# EAGLE schematic RF08b (EAGLE 6.6.0)

## Sheet 1 of 3
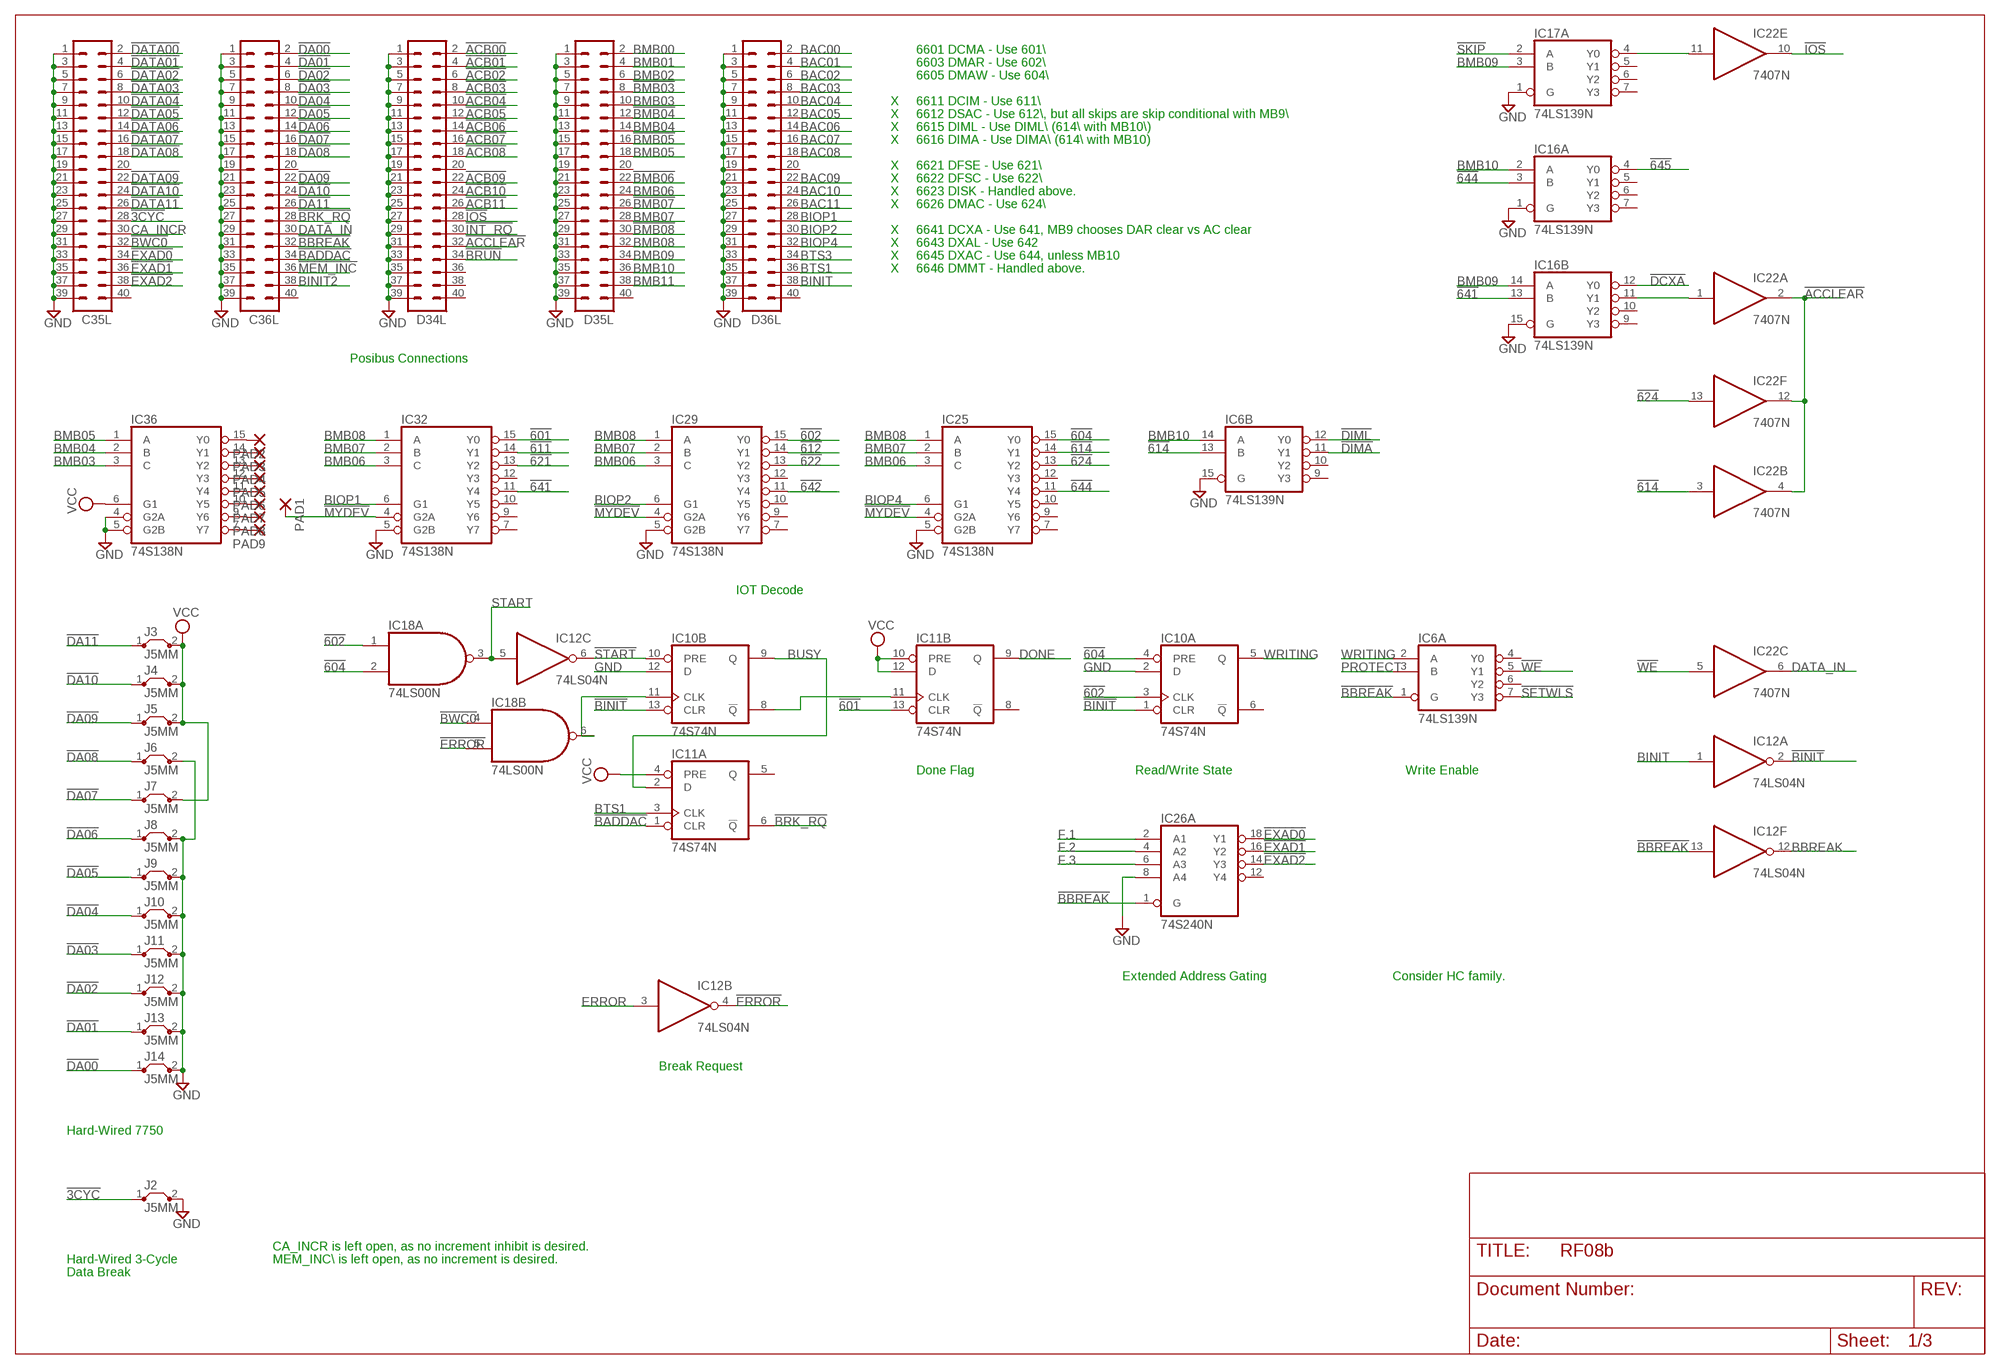
[diagram p0: schematic, sheet 1]

### Parts
C35L  MA20-2  [MA20-2]
C36L  MA20-2  [MA20-2]
D34L  MA20-2  [MA20-2]
D35L  MA20-2  [MA20-2]
D36L  MA20-2  [MA20-2]
IC6  74LS139N  74S139N  [DIL16]
IC10  74S74N  [DIL14]
IC11  74S74N  [DIL14]
IC12  74LS04N  [DIL14]
IC16  74LS139N  74S139N  [DIL16]
IC17  74LS139N  74S139N  [DIL16]
IC18  74LS00N  [DIL14]
IC22  7407N  [DIL14]
IC25  74S138N  [DIL16]
IC26  74S240N  [DIL20]
IC29  74S138N  [DIL16]
IC32  74S138N  [DIL16]
IC36  74S138N  [DIL16]
J2  J5MM  [05]
J3  J5MM  [05]
J4  J5MM  [05]
J5  J5MM  [05]
J6  J5MM  [05]
J7  J5MM  [05]
J8  J5MM  [05]
J9  J5MM  [05]
J10  J5MM  [05]
J11  J5MM  [05]
J12  J5MM  [05]
J13  J5MM  [05]
J14  J5MM  [05]
PAD1  1,6/0,8  [1,6/0,8]
PAD2  1,6/0,8  [1,6/0,8]
PAD3  1,6/0,8  [1,6/0,8]
PAD4  1,6/0,8  [1,6/0,8]
PAD5  1,6/0,8  [1,6/0,8]
PAD6  1,6/0,8  [1,6/0,8]
PAD7  1,6/0,8  [1,6/0,8]
PAD8  1,6/0,8  [1,6/0,8]
PAD9  1,6/0,8  [1,6/0,8]

### Nets
!3CYC: C35L.28 J2.1
!601: IC11.13(B:CLR) IC32.15(Y0) ; also sheet 2
!602: IC10.3(A:CLK) IC18.1(A:I0) IC29.15(Y0)
!604: IC10.4(A:PRE) IC18.2(A:I1) IC25.15(Y0)
!611: IC32.14(Y1) ; also sheet 2
!612: IC29.14(Y1) ; also sheet 2
!614: IC6.13(B:B) IC22.3(B:I) IC25.14(Y1)
!621: IC32.13(Y2) ; also sheet 2
!622: IC29.13(Y2) ; also sheet 2
!624: IC22.13(F:I) IC25.13(Y2) ; also sheet 2
!641: IC16.13(B:B) IC32.11(Y4)
!642: IC29.11(Y4) ; also sheet 2
!644: IC16.3(A:B) IC25.11(Y4)
!645: IC16.4(A:Y0) ; also sheet 2
!ACB00: D34L.2 ; also sheet 2
!ACB01: D34L.4 ; also sheet 2
!ACB02: D34L.6 ; also sheet 2
!ACB03: D34L.8 ; also sheet 2
!ACB04: D34L.10 ; also sheet 2
!ACB05: D34L.12 ; also sheet 2
!ACB06: D34L.14 ; also sheet 2
!ACB07: D34L.16 ; also sheet 2
!ACB08: D34L.18 ; also sheet 2
!ACB09: D34L.22 ; also sheet 2
!ACB10: D34L.24 ; also sheet 2
!ACB11: D34L.26 ; also sheet 2
!ACCLEAR: D34L.32 IC22.2(A:O) IC22.4(B:O) IC22.12(F:O)
!BADDAC: C36L.34 IC11.1(A:CLR)
!BBREAK: C36L.32 IC6.1(A:G) IC12.13(F:I) IC26.1(A:G) ; also sheet 3
!BINIT: IC10.1(A:CLR) IC10.13(B:CLR) IC12.2(A:O) ; also sheet 2
!BMB03: D35L.8
!BMB04: D35L.12
!BMB05: D35L.16
!BMB06: D35L.22
!BMB07: D35L.26
!BMB08: D35L.30
!BRK_RQ: C36L.28 IC11.6(A:!Q) ; also sheet 3
!BRUN: D34L.34
!BWC0: C35L.32 IC18.4(B:I0) ; also sheet 3
!DA00: C36L.2 J14.1
!DA01: C36L.4 J13.1
!DA02: C36L.6 J12.1
!DA03: C36L.8 J11.1
!DA04: C36L.10 J10.1
!DA05: C36L.12 J9.1
!DA06: C36L.14 J8.1
!DA07: C36L.16 J7.1
!DA08: C36L.18 J6.1
!DA09: C36L.22 J5.1
!DA10: C36L.24 J4.1
!DA11: C36L.26 J3.1
!DATA00: C35L.2 ; also sheet 3
!DATA01: C35L.4 ; also sheet 3
!DATA02: C35L.6 ; also sheet 3
!DATA03: C35L.8 ; also sheet 3
!DATA04: C35L.10 ; also sheet 3
!DATA05: C35L.12 ; also sheet 3
!DATA06: C35L.14 ; also sheet 3
!DATA07: C35L.16 ; also sheet 3
!DATA08: C35L.18 ; also sheet 3
!DATA09: C35L.22 ; also sheet 3
!DATA10: C35L.24 ; also sheet 3
!DATA11: C35L.26 ; also sheet 3
!DCXA: IC16.12(B:Y0) ; also sheet 2
!DIMA: IC6.11(B:Y1) ; also sheet 2
!DIML: IC6.12(B:Y0) ; also sheet 2
!ERROR: IC12.4(B:O) IC18.5(B:I1)
!EXAD0: C35L.34 IC26.18(A:Y1)
!EXAD1: C35L.36 IC26.16(A:Y2)
!EXAD2: C35L.38 IC26.14(A:Y3)
!INT_RQ: D34L.30 ; also sheet 2
!IOS: D34L.28 IC22.10(E:O)
!MEM_INC: C36L.36
!MYDEV: IC25.4(G2A) IC29.4(G2A) IC32.4(G2A) PAD1.1(P)
!SETWLS: IC6.7(A:Y3) ; also sheet 2
!SKIP: IC17.2(A:A) ; also sheet 2
!START: IC10.10(B:PRE) IC12.6(C:O) ; also sheet 2
!WE: IC6.5(A:Y1) IC22.5(C:I) ; also sheet 3
BAC00: D36L.2 ; also sheet 2
BAC01: D36L.4 ; also sheet 2
BAC02: D36L.6 ; also sheet 2
BAC03: D36L.8 ; also sheet 2
BAC04: D36L.10 ; also sheet 2
BAC05: D36L.12 ; also sheet 2
BAC06: D36L.14 ; also sheet 2
BAC07: D36L.16 ; also sheet 2
BAC08: D36L.18 ; also sheet 2
BAC09: D36L.22 ; also sheet 2
BAC10: D36L.24 ; also sheet 2
BAC11: D36L.26 ; also sheet 2
BBREAK: IC12.12(F:O) ; also sheet 2
BINIT: D36L.38 IC12.1(A:I)
BINIT2: C36L.38
BIOP1: D36L.28 IC32.6(G1)
BIOP2: D36L.30 IC29.6(G1)
BIOP4: D36L.32 IC25.6(G1)
BMB00: D35L.2 ; also sheet 3
BMB01: D35L.4 ; also sheet 3
BMB02: D35L.6 ; also sheet 3
BMB03: D35L.10 IC36.3(C) ; also sheet 3
BMB04: D35L.14 IC36.2(B) ; also sheet 3
BMB05: D35L.18 IC36.1(A) ; also sheet 3
BMB06: D35L.24 IC25.3(C) IC29.3(C) IC32.3(C) ; also sheet 3
BMB07: D35L.28 IC25.2(B) IC29.2(B) IC32.2(B) ; also sheet 3
BMB08: D35L.32 IC25.1(A) IC29.1(A) IC32.1(A) ; also sheet 3
BMB09: D35L.34 IC16.14(B:A) IC17.3(A:B) ; also sheet 3
BMB10: D35L.36 IC6.14(B:A) IC16.2(A:A) ; also sheet 3
BMB11: D35L.38 ; also sheet 3
BTS1: D36L.36 IC11.3(A:CLK)
BTS3: D36L.34
BUSY: IC10.9(B:Q) IC11.2(A:D) ; also sheet 2
CA_INCR: C35L.30
DATA_IN: C36L.30 IC22.6(C:O)
DONE: IC11.9(B:Q) ; also sheet 2,3
ERROR: IC12.3(B:I) ; also sheet 2
F.1: IC26.2(A:A1) ; also sheet 2,3
F.2: IC26.4(A:A2) ; also sheet 2,3
F.3: IC26.6(A:A3) ; also sheet 2,3
GND: C35L.1 C35L.3 C35L.5 C35L.7 C35L.9 C35L.11 C35L.13 C35L.15 C35L.17 C35L.19 C35L.21 C35L.23 C35L.25 C35L.27 C35L.29 C35L.31 C35L.33 C35L.35 C35L.37 C35L.39 C36L.1 C36L.3 C36L.5 C36L.7 C36L.9 C36L.11 C36L.13 C36L.15 C36L.17 C36L.19 C36L.21 C36L.23 C36L.25 C36L.27 C36L.29 C36L.31 C36L.33 C36L.35 C36L.37 C36L.39 D34L.1 D34L.3 D34L.5 D34L.7 D34L.9 D34L.11 D34L.13 D34L.15 D34L.17 D34L.19 D34L.21 D34L.23 D34L.25 D34L.27 D34L.29 D34L.31 D34L.33 D34L.35 D34L.37 D34L.39 D35L.1 D35L.3 D35L.5 D35L.7 D35L.9 D35L.11 D35L.13 D35L.15 D35L.17 D35L.19 D35L.21 D35L.23 D35L.25 D35L.27 D35L.29 D35L.31 D35L.33 D35L.35 D35L.37 D35L.39 D36L.1 D36L.3 D36L.5 D36L.7 D36L.9 D36L.11 D36L.13 D36L.15 D36L.17 D36L.19 D36L.21 D36L.23 D36L.25 D36L.27 D36L.29 D36L.31 D36L.33 D36L.35 D36L.37 D36L.39 IC6.15(B:G) IC10.2(A:D) IC10.12(B:D) IC16.1(A:G) IC16.15(B:G) IC17.1(A:G) IC25.5(G2B) IC26.8(A:A4) IC29.5(G2B) IC32.5(G2B) IC36.4(G2A) IC36.5(G2B) J2.2 J6.2 J8.2 J9.2 J10.2 J11.2 J12.2 J13.2 J14.2 ; also sheet 2,3
N$1: IC36.9(Y6) PAD8.1(P)
N$2: IC10.8(B:!Q) IC11.11(B:CLK)
N$5: IC36.15(Y0) PAD2.1(P)
N$6: IC36.14(Y1) PAD3.1(P)
N$7: IC36.13(Y2) PAD4.1(P)
N$8: IC36.12(Y3) PAD5.1(P)
N$9: IC36.11(Y4) PAD6.1(P)
N$10: IC36.10(Y5) PAD7.1(P)
N$11: IC36.7(Y7) PAD9.1(P)
N$18: IC10.11(B:CLK) IC18.6(B:O)
N$26: IC16.11(B:Y1) IC22.1(A:I)
N$27: IC17.4(A:Y0) IC22.11(E:I)
PROTECT: IC6.3(A:B) ; also sheet 3
START: IC12.5(C:I) IC18.3(A:O)
VCC [Power]: IC11.4(A:PRE) IC11.10(B:PRE) IC11.12(B:D) IC36.6(G1) J3.2 J4.2 J5.2 J7.2 ; also sheet 2,3
WRITING: IC6.2(A:A) IC10.5(A:Q) ; also sheet 3
Unconnected: C35L.20 C35L.40 C36L.20 C36L.40 D34L.20 D34L.36 D34L.38 D34L.40 D35L.20 D35L.40 D36L.20 D36L.40 IC6.4(A:Y0) IC6.6(A:Y2) IC6.9(B:Y3) IC6.10(B:Y2) IC10.6(A:!Q) IC11.5(A:Q) IC11.8(B:!Q) IC16.5(A:Y1) IC16.6(A:Y2) IC16.7(A:Y3) IC16.9(B:Y3) IC16.10(B:Y2) IC17.5(A:Y1) IC17.6(A:Y2) IC17.7(A:Y3) IC17.9(B:Y3) IC17.10(B:Y2) IC17.11(B:Y1) IC17.12(B:Y0) IC17.13(B:B) IC17.14(B:A) IC17.15(B:G) IC22.8(D:O) IC22.9(D:I) IC25.7(Y7) IC25.9(Y6) IC25.10(Y5) IC25.12(Y3) IC26.12(A:Y4) IC29.7(Y7) IC29.9(Y6) IC29.10(Y5) IC29.12(Y3) IC32.7(Y7) IC32.9(Y6) IC32.10(Y5) IC32.12(Y3)

### Notes on the sheet
- 6601 DCMA - Use 601\\
- 6603 DMAR - Use 602\\
- 6605 DMAW - Use 604\\
- X | 6611 DCIM - Use 611\\
- X | 6612 DSAC - Use 612\\, but all skips are skip conditional with MB9\\
- X | 6615 DIML - Use DIML\\ (614\\ with MB10\\)
- X | 6616 DIMA - Use DIMA\\ (614\\ with MB10)
- X | 6621 DFSE - Use 621\\
- X | 6622 DFSC - Use 622\\
- X | 6623 DISK - Handled above.
- X | 6626 DMAC - Use 624\\
- X | 6641 DCXA - Use 641, MB9 chooses DAR clear vs AC clear
- X | 6643 DXAL - Use 642
- X | 6645 DXAC - Use 644, unless MB10
- X | 6646 DMMT - Handled above.
- Posibus Connections
- IOT Decode
- Done Flag | Read/Write State | Write Enable
- Extended Address Gating | Consider HC family.
- Break Request
- Hard-Wired 7750
- CA_INCR is left open, as no increment inhibit is desired.
- Hard-Wired 3-Cycle | MEM_INC\\ is left open, as no increment is desired.
- Data Break

## Sheet 2 of 3
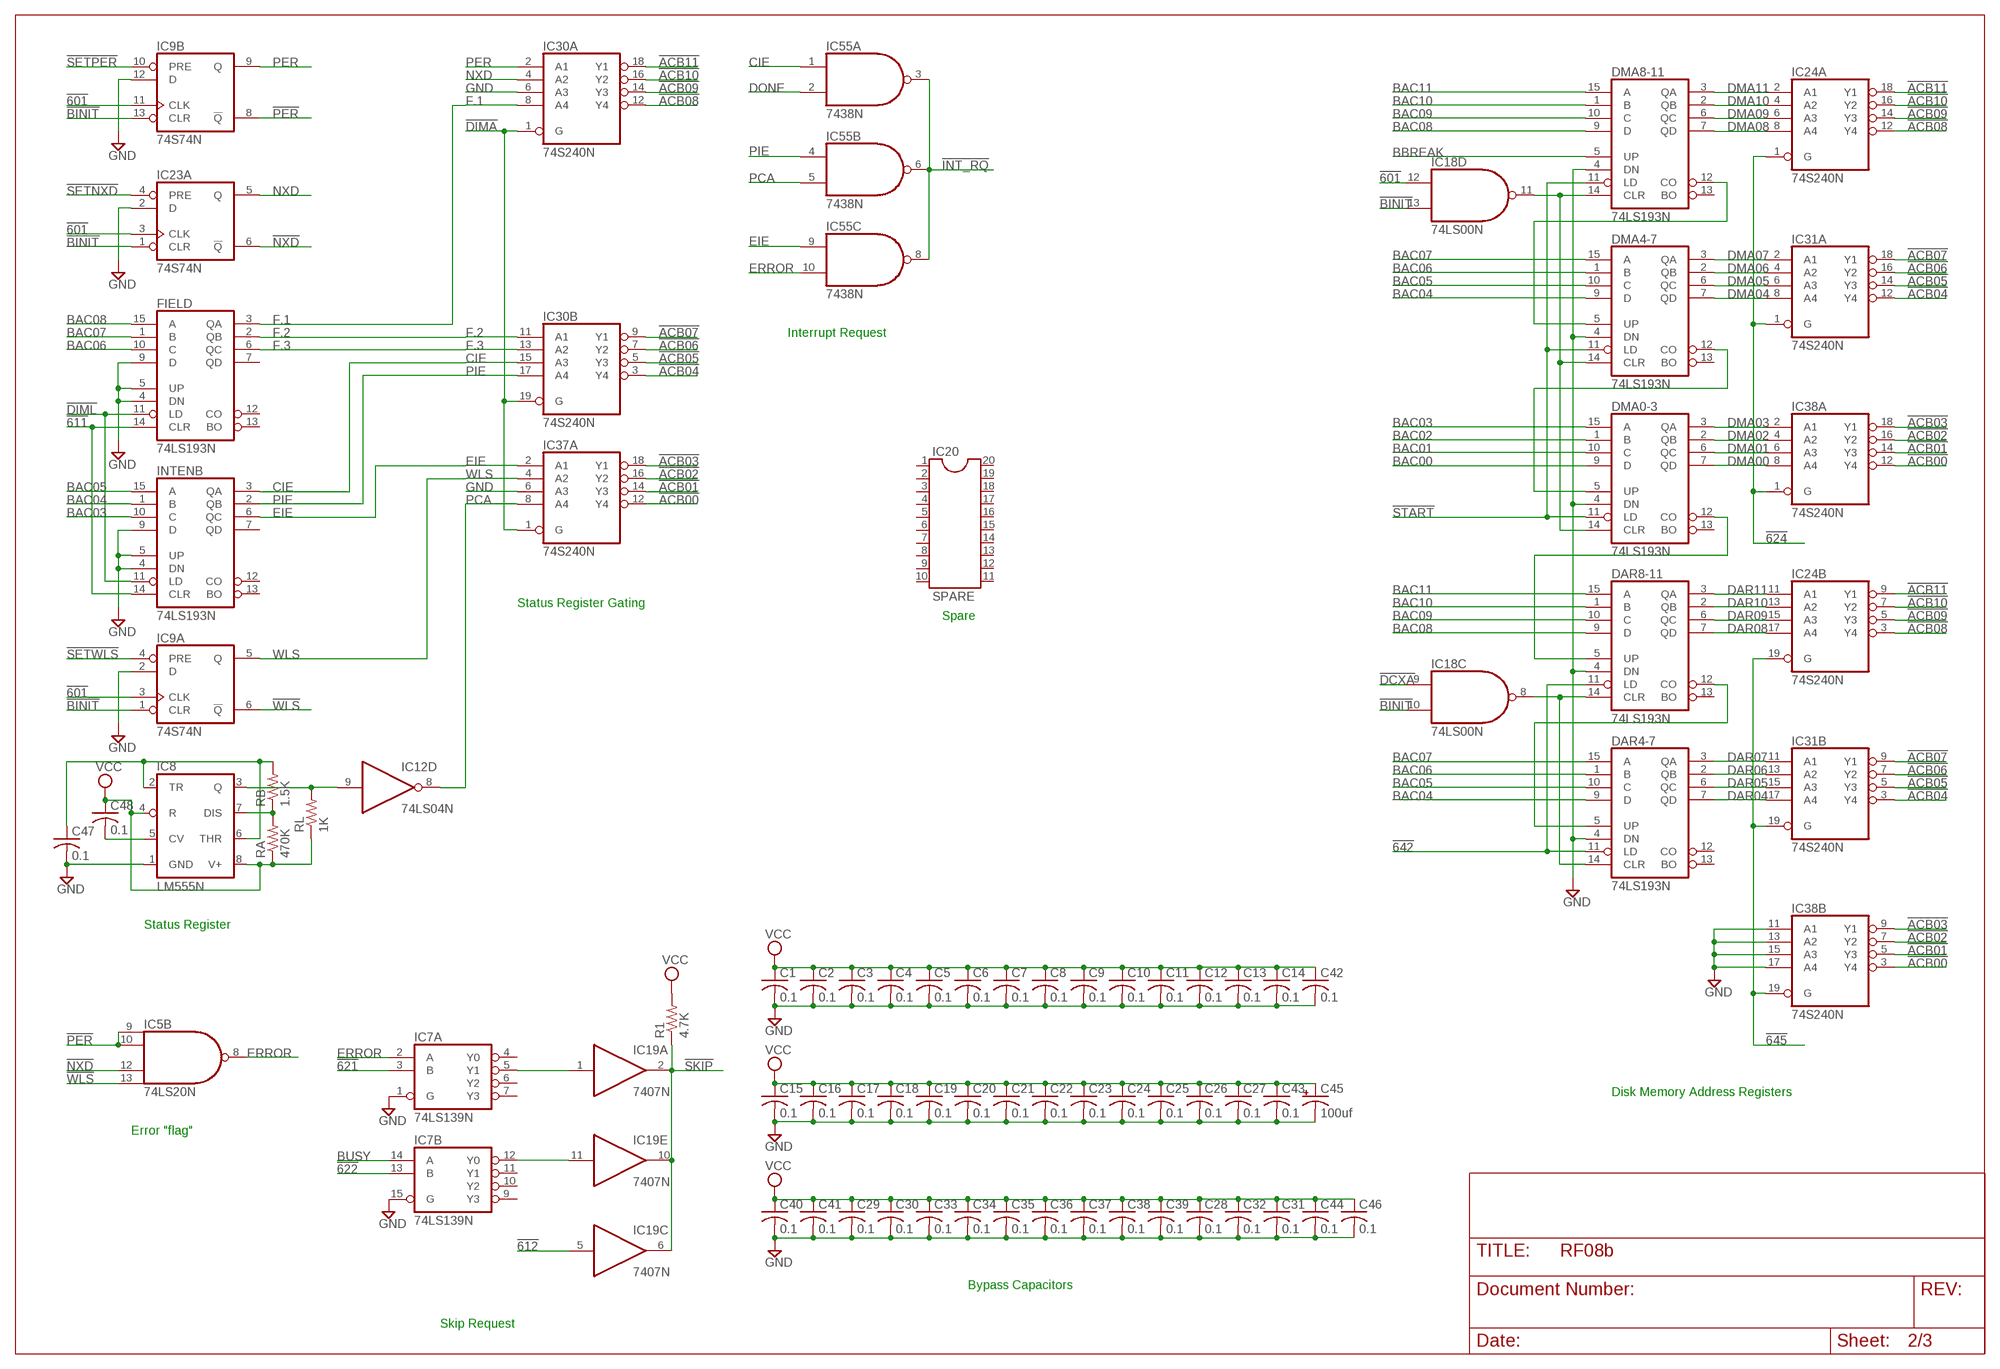
[diagram p1: schematic, sheet 2]

### Parts
C1  0.1  C-US050-025X075  [C050-025X075]
C2  0.1  C-US050-025X075  [C050-025X075]
C3  0.1  C-US050-025X075  [C050-025X075]
C4  0.1  C-US050-025X075  [C050-025X075]
C5  0.1  C-US050-025X075  [C050-025X075]
C6  0.1  C-US050-025X075  [C050-025X075]
C7  0.1  C-US050-025X075  [C050-025X075]
C8  0.1  C-US050-025X075  [C050-025X075]
C9  0.1  C-US050-025X075  [C050-025X075]
C10  0.1  C-US050-025X075  [C050-025X075]
C11  0.1  C-US050-025X075  [C050-025X075]
C12  0.1  C-US050-025X075  [C050-025X075]
C13  0.1  C-US050-025X075  [C050-025X075]
C14  0.1  C-US050-025X075  [C050-025X075]
C15  0.1  C-US050-025X075  [C050-025X075]
C16  0.1  C-US050-025X075  [C050-025X075]
C17  0.1  C-US050-025X075  [C050-025X075]
C18  0.1  C-US050-025X075  [C050-025X075]
C19  0.1  C-US050-025X075  [C050-025X075]
C20  0.1  C-US050-025X075  [C050-025X075]
C21  0.1  C-US050-025X075  [C050-025X075]
C22  0.1  C-US050-025X075  [C050-025X075]
C23  0.1  C-US050-025X075  [C050-025X075]
C24  0.1  C-US050-025X075  [C050-025X075]
C25  0.1  C-US050-025X075  [C050-025X075]
C26  0.1  C-US050-025X075  [C050-025X075]
C27  0.1  C-US050-025X075  [C050-025X075]
C28  0.1  C-US050-025X075  [C050-025X075]
C29  0.1  C-US050-025X075  [C050-025X075]
C30  0.1  C-US050-025X075  [C050-025X075]
C31  0.1  C-US050-025X075  [C050-025X075]
C32  0.1  C-US050-025X075  [C050-025X075]
C33  0.1  C-US050-025X075  [C050-025X075]
C34  0.1  C-US050-025X075  [C050-025X075]
C35  0.1  C-US050-025X075  [C050-025X075]
C36  0.1  C-US050-025X075  [C050-025X075]
C37  0.1  C-US050-025X075  [C050-025X075]
C38  0.1  C-US050-025X075  [C050-025X075]
C39  0.1  C-US050-025X075  [C050-025X075]
C40  0.1  C-US050-025X075  [C050-025X075]
C41  0.1  C-US050-025X075  [C050-025X075]
C42  0.1  C-US050-025X075  [C050-025X075]
C43  0.1  C-US050-025X075  [C050-025X075]
C44  0.1  C-US050-025X075  [C050-025X075]
C45  100uf  CPOL-USE22-6AXIAL  [E22-6]
C46  0.1  C-US050-025X075  [C050-025X075]
C47  0.1  C-US050-025X075  [C050-025X075]
C48  0.1  C-US050-025X075  [C050-025X075]
DAR4-7  74LS193N  74LS192N  [DIL16]
DAR8-11  74LS193N  74LS192N  [DIL16]
DMA0-3  74LS193N  74LS192N  [DIL16]
DMA4-7  74LS193N  74LS192N  [DIL16]
DMA8-11  74LS193N  74LS192N  [DIL16]
FIELD  74LS193N  74LS192N  [DIL16]
IC5  74LS20N  [DIL14]
IC7  74LS139N  [DIL16]
IC8  LM555N  [DIL08]
IC9  74S74N  [DIL14]
IC19  7407N  [DIL14]
IC20  SPARE  DIL20  [DIL20]
IC23  74S74N  [DIL14]
IC24  74S240N  [DIL20]
IC30  74S240N  [DIL20]
IC31  74S240N  [DIL20]
IC37  74S240N  [DIL20]
IC38  74S240N  [DIL20]
IC55  7438N  [DIL14]
INTENB  74LS193N  74LS192N  [DIL16]
R1  4.7K  R-US_0207/10  [0207/10]
RA  470K  R-US_0207/10  [0207/10]
RB  1.5K  R-US_0207/10  [0207/10]
RL  1K  R-US_0207/10  [0207/10]

### Nets
!601: IC9.3(A:CLK) IC9.11(B:CLK) IC18.12(D:I0) IC23.3(A:CLK) ; also sheet 1
!611: FIELD.14(CLR) INTENB.14(CLR) ; also sheet 1
!612: IC19.5(C:I) ; also sheet 1
!621: IC7.3(A:B) ; also sheet 1
!622: IC7.13(B:B) ; also sheet 1
!624: IC24.1(A:G) IC31.1(A:G) IC38.1(A:G) ; also sheet 1
!642: DAR4-7.11(LD) DAR8-11.11(LD) ; also sheet 1
!645: IC24.19(B:G) IC31.19(B:G) IC38.19(B:G) ; also sheet 1
!ACB00: IC37.12(A:Y4) IC38.3(B:Y4) IC38.12(A:Y4) ; also sheet 1
!ACB01: IC37.14(A:Y3) IC38.5(B:Y3) IC38.14(A:Y3) ; also sheet 1
!ACB02: IC37.16(A:Y2) IC38.7(B:Y2) IC38.16(A:Y2) ; also sheet 1
!ACB03: IC37.18(A:Y1) IC38.9(B:Y1) IC38.18(A:Y1) ; also sheet 1
!ACB04: IC30.3(B:Y4) IC31.3(B:Y4) IC31.12(A:Y4) ; also sheet 1
!ACB05: IC30.5(B:Y3) IC31.5(B:Y3) IC31.14(A:Y3) ; also sheet 1
!ACB06: IC30.7(B:Y2) IC31.7(B:Y2) IC31.16(A:Y2) ; also sheet 1
!ACB07: IC30.9(B:Y1) IC31.9(B:Y1) IC31.18(A:Y1) ; also sheet 1
!ACB08: IC24.3(B:Y4) IC24.12(A:Y4) IC30.12(A:Y4) ; also sheet 1
!ACB09: IC24.5(B:Y3) IC24.14(A:Y3) IC30.14(A:Y3) ; also sheet 1
!ACB10: IC24.7(B:Y2) IC24.16(A:Y2) IC30.16(A:Y2) ; also sheet 1
!ACB11: IC24.9(B:Y1) IC24.18(A:Y1) IC30.18(A:Y1) ; also sheet 1
!BINIT: IC9.1(A:CLR) IC9.13(B:CLR) IC18.10(C:I1) IC18.13(D:I1) IC23.1(A:CLR) ; also sheet 1
!DCXA: IC18.9(C:I0) ; also sheet 1
!DIMA: IC30.1(A:G) IC30.19(B:G) IC37.1(A:G) ; also sheet 1
!DIML: FIELD.11(LD) INTENB.11(LD) ; also sheet 1
!INT_RQ: IC55.3(A:O) IC55.6(B:O) IC55.8(C:O) ; also sheet 1
!NXD: IC5.12(B:I2) IC23.6(A:!Q)
!PER: IC5.9(B:I0) IC5.10(B:I1) IC9.8(B:!Q)
!SETNXD: IC23.4(A:PRE) ; also sheet 3
!SETPER: IC9.10(B:PRE) ; also sheet 3
!SETWLS: IC9.4(A:PRE) ; also sheet 1
!SKIP: IC19.2(A:O) IC19.6(C:O) IC19.10(E:O) R1.1 ; also sheet 1
!START: DMA0-3.11(LD) DMA4-7.11(LD) DMA8-11.11(LD) ; also sheet 1
!WLS: IC5.13(B:I3) IC9.6(A:!Q)
BAC00: DMA0-3.9(D) ; also sheet 1
BAC01: DMA0-3.10(C) ; also sheet 1
BAC02: DMA0-3.1(B) ; also sheet 1
BAC03: DMA0-3.15(A) INTENB.10(C) ; also sheet 1
BAC04: DAR4-7.9(D) DMA4-7.9(D) INTENB.1(B) ; also sheet 1
BAC05: DAR4-7.10(C) DMA4-7.10(C) INTENB.15(A) ; also sheet 1
BAC06: DAR4-7.1(B) DMA4-7.1(B) FIELD.10(C) ; also sheet 1
BAC07: DAR4-7.15(A) DMA4-7.15(A) FIELD.1(B) ; also sheet 1
BAC08: DAR8-11.9(D) DMA8-11.9(D) FIELD.15(A) ; also sheet 1
BAC09: DAR8-11.10(C) DMA8-11.10(C) ; also sheet 1
BAC10: DAR8-11.1(B) DMA8-11.1(B) ; also sheet 1
BAC11: DAR8-11.15(A) DMA8-11.15(A) ; also sheet 1
BBREAK: DMA8-11.5(UP) ; also sheet 1
BUSY: IC7.14(B:A) ; also sheet 1
CIE: IC30.15(B:A3) IC55.1(A:I0) INTENB.3(QA) ; also sheet 3
DAR04: DAR4-7.7(QD) IC31.17(B:A4) ; also sheet 3
DAR05: DAR4-7.6(QC) IC31.15(B:A3) ; also sheet 3
DAR06: DAR4-7.2(QB) IC31.13(B:A2) ; also sheet 3
DAR07: DAR4-7.3(QA) IC31.11(B:A1) ; also sheet 3
DAR08: DAR8-11.7(QD) IC24.17(B:A4) ; also sheet 3
DAR09: DAR8-11.6(QC) IC24.15(B:A3) ; also sheet 3
DAR10: DAR8-11.2(QB) IC24.13(B:A2) ; also sheet 3
DAR11: DAR8-11.3(QA) IC24.11(B:A1) ; also sheet 3
DMA00: DMA0-3.7(QD) IC38.8(A:A4) ; also sheet 3
DMA01: DMA0-3.6(QC) IC38.6(A:A3) ; also sheet 3
DMA02: DMA0-3.2(QB) IC38.4(A:A2) ; also sheet 3
DMA03: DMA0-3.3(QA) IC38.2(A:A1) ; also sheet 3
DMA04: DMA4-7.7(QD) IC31.8(A:A4) ; also sheet 3
DMA05: DMA4-7.6(QC) IC31.6(A:A3) ; also sheet 3
DMA06: DMA4-7.2(QB) IC31.4(A:A2) ; also sheet 3
DMA07: DMA4-7.3(QA) IC31.2(A:A1) ; also sheet 3
DMA08: DMA8-11.7(QD) IC24.8(A:A4) ; also sheet 3
DMA09: DMA8-11.6(QC) IC24.6(A:A3) ; also sheet 3
DMA10: DMA8-11.2(QB) IC24.4(A:A2) ; also sheet 3
DMA11: DMA8-11.3(QA) IC24.2(A:A1) ; also sheet 3
DONE: IC55.2(A:I1) ; also sheet 1,3
EIE: IC37.2(A:A1) IC55.9(C:I0) INTENB.6(QC) ; also sheet 3
ERROR: IC5.8(B:O) IC7.2(A:A) IC55.10(C:I1) ; also sheet 1
F.1: FIELD.3(QA) IC30.8(A:A4) ; also sheet 1,3
F.2: FIELD.2(QB) IC30.11(B:A1) ; also sheet 1,3
F.3: FIELD.6(QC) IC30.13(B:A2) ; also sheet 1,3
GND: C1.2 C2.2 C3.2 C4.2 C5.2 C6.2 C7.2 C8.2 C9.2 C10.2 C11.2 C12.2 C13.2 C14.2 C15.2 C16.2 C17.2 C18.2 C19.2 C20.2 C21.2 C22.2 C23.2 C24.2 C25.2 C26.2 C27.2 C28.2 C29.2 C30.2 C31.2 C32.2 C33.2 C34.2 C35.2 C36.2 C37.2 C38.2 C39.2 C40.2 C41.2 C42.2 C43.2 C44.2 C45.- C46.2 C47.2 DAR4-7.4(DN) DAR8-11.4(DN) DMA0-3.4(DN) DMA4-7.4(DN) DMA8-11.4(DN) FIELD.4(DN) FIELD.5(UP) FIELD.9(D) IC7.1(A:G) IC7.15(B:G) IC8.1(GND) IC9.2(A:D) IC9.12(B:D) IC23.2(A:D) IC30.6(A:A3) IC37.6(A:A3) IC38.11(B:A1) IC38.13(B:A2) IC38.15(B:A3) IC38.17(B:A4) INTENB.4(DN) INTENB.5(UP) INTENB.9(D) ; also sheet 1,3
N$3: DMA0-3.5(UP) DMA4-7.12(CO)
N$12: DAR4-7.14(CLR) DAR8-11.14(CLR) IC18.8(C:O)
N$13: DMA4-7.5(UP) DMA8-11.12(CO)
N$16: DAR8-11.5(UP) DMA0-3.12(CO)
N$22: DMA0-3.14(CLR) DMA4-7.14(CLR) DMA8-11.14(CLR) IC18.11(D:O)
N$25: DAR4-7.5(UP) DAR8-11.12(CO)
N$28: IC7.5(A:Y1) IC19.1(A:I)
N$29: IC8.7(DIS) RA.2 RB.1
N$30: IC8.3(Q) IC12.9(D:I) RL.2
N$32: C47.1 IC8.2(TR) IC8.6(THR) RB.2
N$33: IC7.12(B:Y0) IC19.11(E:I)
N$34: C48.2 IC8.5(CV)
NXD: IC23.5(A:Q) IC30.4(A:A2) ; also sheet 3
PCA: IC12.8(D:O) IC37.8(A:A4) IC55.5(B:I1)
PER: IC9.9(B:Q) IC30.2(A:A1) ; also sheet 3
PIE: IC30.17(B:A4) IC55.4(B:I0) INTENB.2(QB) ; also sheet 3
VCC [Power]: C1.1 C2.1 C3.1 C4.1 C5.1 C6.1 C7.1 C8.1 C9.1 C10.1 C11.1 C12.1 C13.1 C14.1 C15.1 C16.1 C17.1 C18.1 C19.1 C20.1 C21.1 C22.1 C23.1 C24.1 C25.1 C26.1 C27.1 C28.1 C29.1 C30.1 C31.1 C32.1 C33.1 C34.1 C35.1 C36.1 C37.1 C38.1 C39.1 C40.1 C41.1 C42.1 C43.1 C44.1 C45.+ C46.1 C48.1 IC8.4(R) IC8.8(V+) R1.2 RA.1 RL.1 ; also sheet 1,3
WLS: IC9.5(A:Q) IC37.4(A:A2) ; also sheet 3
Unconnected: DAR4-7.12(CO) DAR4-7.13(BO) DAR8-11.13(BO) DMA0-3.13(BO) DMA4-7.13(BO) DMA8-11.13(BO) FIELD.7(QD) FIELD.12(CO) FIELD.13(BO) IC7.4(A:Y0) IC7.6(A:Y2) IC7.7(A:Y3) IC7.9(B:Y3) IC7.10(B:Y2) IC7.11(B:Y1) IC19.3(B:I) IC19.4(B:O) IC19.8(D:O) IC19.9(D:I) IC19.12(F:O) IC19.13(F:I) IC20.1 IC20.2 IC20.3 IC20.4 IC20.5 IC20.6 IC20.7 IC20.8 IC20.9 IC20.10 IC20.11 IC20.12 IC20.13 IC20.14 IC20.15 IC20.16 IC20.17 IC20.18 IC20.19 IC20.20 IC23.8(B:!Q) IC23.9(B:Q) IC23.10(B:PRE) IC23.11(B:CLK) IC23.12(B:D) IC23.13(B:CLR) IC37.3(B:Y4) IC37.5(B:Y3) IC37.7(B:Y2) IC37.9(B:Y1) IC37.11(B:A1) IC37.13(B:A2) IC37.15(B:A3) IC37.17(B:A4) IC37.19(B:G) IC55.11(D:O) IC55.12(D:I0) IC55.13(D:I1) INTENB.7(QD) INTENB.12(CO) INTENB.13(BO)

### Notes on the sheet
- Interrupt Request
- Status Register Gating
- Spare
- Status Register
- Disk Memory Address Registers
- Error "flag"
- Bypass Capacitors
- Skip Request

## Sheet 3 of 3
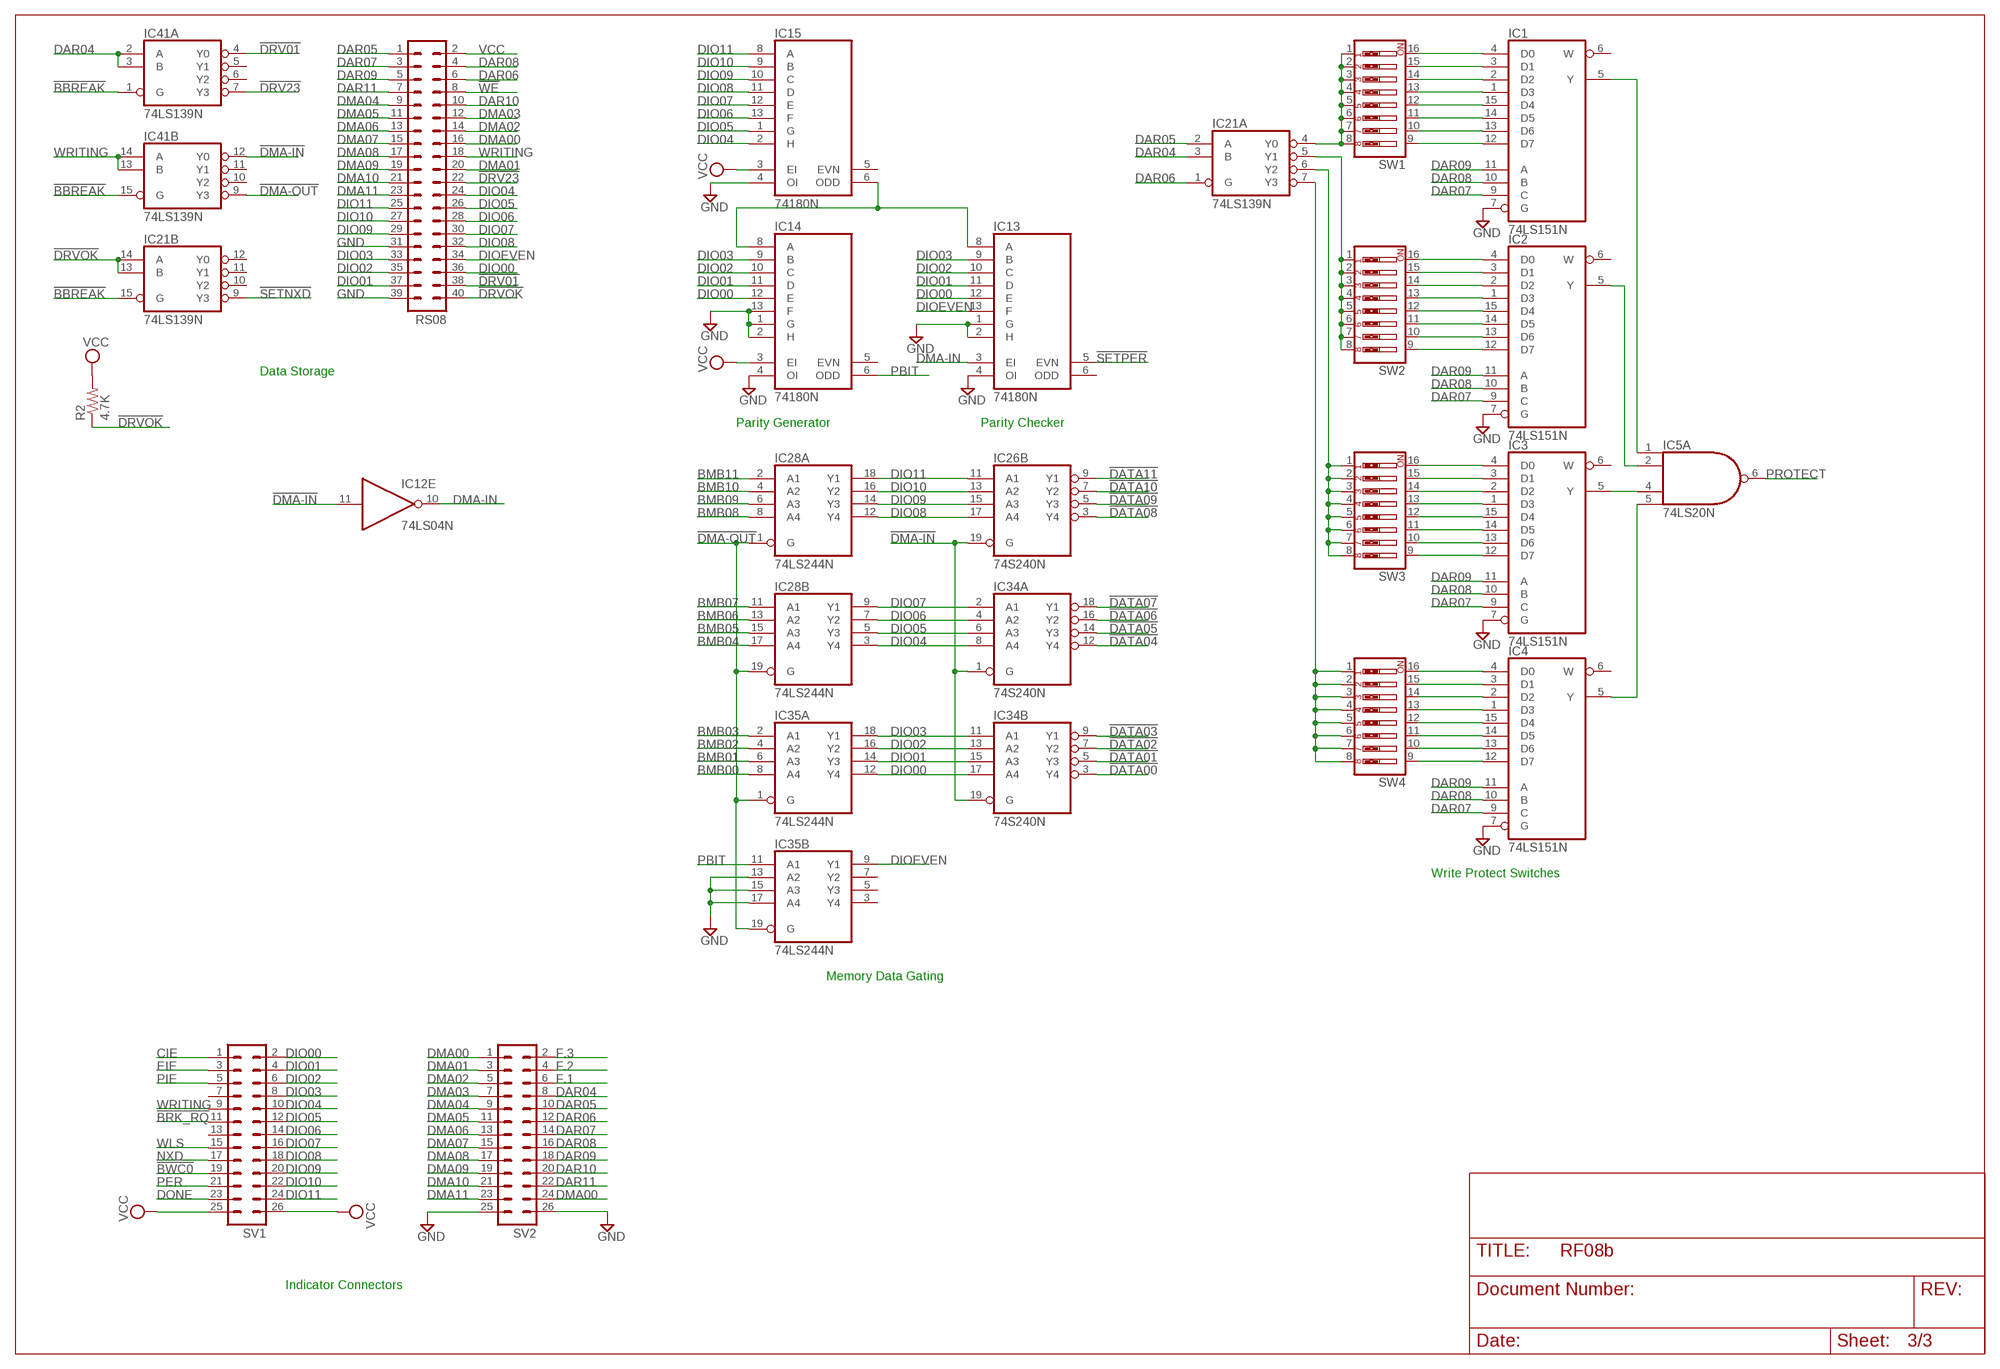
[diagram p2: schematic, sheet 3]

### Parts
IC1  74LS151N  [DIL16]
IC2  74LS151N  [DIL16]
IC3  74LS151N  [DIL16]
IC4  74LS151N  [DIL16]
IC13  74180N  [DIL14]
IC14  74180N  [DIL14]
IC15  74180N  [DIL14]
IC21  74LS139N  [DIL16]
IC28  74LS244N  [DIL20]
IC34  74S240N  [DIL20]
IC35  74LS244N  [DIL20]
IC41  74LS139N  [DIL16]
R2  4.7K  R-US_0207/10  [0207/10]
RS08  MA20-2  [MA20-2]
SV1  MA13-2  [MA13-2]
SV2  MA13-2  [MA13-2]
SW1  SW_DIP-8  [EDG-08]
SW2  SW_DIP-8  [EDG-08]
SW3  SW_DIP-8  [EDG-08]
SW4  SW_DIP-8  [EDG-08]

### Nets
!BBREAK: IC21.15(B:G) IC41.1(A:G) IC41.15(B:G) ; also sheet 1
!BRK_RQ: SV1.11 ; also sheet 1
!BWC0: SV1.19 ; also sheet 1
!DATA00: IC34.3(B:Y4) ; also sheet 1
!DATA01: IC34.5(B:Y3) ; also sheet 1
!DATA02: IC34.7(B:Y2) ; also sheet 1
!DATA03: IC34.9(B:Y1) ; also sheet 1
!DATA04: IC34.12(A:Y4) ; also sheet 1
!DATA05: IC34.14(A:Y3) ; also sheet 1
!DATA06: IC34.16(A:Y2) ; also sheet 1
!DATA07: IC34.18(A:Y1) ; also sheet 1
!DATA08: IC26.3(B:Y4) ; also sheet 1
!DATA09: IC26.5(B:Y3) ; also sheet 1
!DATA10: IC26.7(B:Y2) ; also sheet 1
!DATA11: IC26.9(B:Y1) ; also sheet 1
!DMA-IN: IC12.11(E:I) IC26.19(B:G) IC34.1(A:G) IC34.19(B:G) IC41.12(B:Y0)
!DMA-OUT: IC28.1(A:G) IC28.19(B:G) IC35.1(A:G) IC35.19(B:G) IC41.9(B:Y3)
!DRV01: IC41.4(A:Y0) RS08.38
!DRV23: IC41.7(A:Y3) RS08.22
!DRVOK: IC21.13(B:B) IC21.14(B:A) R2.1 RS08.40
!SETNXD: IC21.9(B:Y3) ; also sheet 2
!SETPER: IC13.5(EVN) ; also sheet 2
!WE: RS08.8 ; also sheet 1
BMB00: IC35.8(A:A4) ; also sheet 1
BMB01: IC35.6(A:A3) ; also sheet 1
BMB02: IC35.4(A:A2) ; also sheet 1
BMB03: IC35.2(A:A1) ; also sheet 1
BMB04: IC28.17(B:A4) ; also sheet 1
BMB05: IC28.15(B:A3) ; also sheet 1
BMB06: IC28.13(B:A2) ; also sheet 1
BMB07: IC28.11(B:A1) ; also sheet 1
BMB08: IC28.8(A:A4) ; also sheet 1
BMB09: IC28.6(A:A3) ; also sheet 1
BMB10: IC28.4(A:A2) ; also sheet 1
BMB11: IC28.2(A:A1) ; also sheet 1
CIE: SV1.1 ; also sheet 2
DAR04: IC21.3(A:B) IC41.2(A:A) IC41.3(A:B) SV2.8 ; also sheet 2
DAR05: IC21.2(A:A) RS08.1 SV2.10 ; also sheet 2
DAR06: IC21.1(A:G) RS08.6 SV2.12 ; also sheet 2
DAR07: IC1.9(C) IC2.9(C) IC3.9(C) IC4.9(C) RS08.3 SV2.14 ; also sheet 2
DAR08: IC1.10(B) IC2.10(B) IC3.10(B) IC4.10(B) RS08.4 SV2.16 ; also sheet 2
DAR09: IC1.11(A) IC2.11(A) IC3.11(A) IC4.11(A) RS08.5 SV2.18 ; also sheet 2
DAR10: RS08.10 SV2.20 ; also sheet 2
DAR11: RS08.7 SV2.22 ; also sheet 2
DIO00: IC13.12(E) IC14.12(E) IC34.17(B:A4) IC35.12(A:Y4) RS08.36 SV1.2
DIO01: IC13.11(D) IC14.11(D) IC34.15(B:A3) IC35.14(A:Y3) RS08.37 SV1.4
DIO02: IC13.10(C) IC14.10(C) IC34.13(B:A2) IC35.16(A:Y2) RS08.35 SV1.6
DIO03: IC13.9(B) IC14.9(B) IC34.11(B:A1) IC35.18(A:Y1) RS08.33 SV1.8
DIO04: IC15.2(H) IC28.3(B:Y4) IC34.8(A:A4) RS08.24 SV1.10
DIO05: IC15.1(G) IC28.5(B:Y3) IC34.6(A:A3) RS08.26 SV1.12
DIO06: IC15.13(F) IC28.7(B:Y2) IC34.4(A:A2) RS08.28 SV1.14
DIO07: IC15.12(E) IC28.9(B:Y1) IC34.2(A:A1) RS08.30 SV1.16
DIO08: IC15.11(D) IC26.17(B:A4) IC28.12(A:Y4) RS08.32 SV1.18
DIO09: IC15.10(C) IC26.15(B:A3) IC28.14(A:Y3) RS08.29 SV1.20
DIO10: IC15.9(B) IC26.13(B:A2) IC28.16(A:Y2) RS08.27 SV1.22
DIO11: IC15.8(A) IC26.11(B:A1) IC28.18(A:Y1) RS08.25 SV1.24
DIOEVEN: IC13.13(F) IC35.9(B:Y1) RS08.34
DMA00: RS08.16 SV2.1 SV2.24 ; also sheet 2
DMA01: RS08.20 SV2.3 ; also sheet 2
DMA02: RS08.14 SV2.5 ; also sheet 2
DMA03: RS08.12 SV2.7 ; also sheet 2
DMA04: RS08.9 SV2.9 ; also sheet 2
DMA05: RS08.11 SV2.11 ; also sheet 2
DMA06: RS08.13 SV2.13 ; also sheet 2
DMA07: RS08.15 SV2.15 ; also sheet 2
DMA08: RS08.17 SV2.17 ; also sheet 2
DMA09: RS08.19 SV2.19 ; also sheet 2
DMA10: RS08.21 SV2.21 ; also sheet 2
DMA11: RS08.23 SV2.23 ; also sheet 2
DMA-IN: IC12.10(E:O) IC13.3(EI)
DONE: SV1.23 ; also sheet 1,2
EIE: SV1.3 ; also sheet 2
F.1: SV2.6 ; also sheet 1,2
F.2: SV2.4 ; also sheet 1,2
F.3: SV2.2 ; also sheet 1,2
GND: IC1.7(G) IC2.7(G) IC3.7(G) IC4.7(G) IC13.1(G) IC13.2(H) IC13.4(OI) IC14.1(G) IC14.2(H) IC14.4(OI) IC14.13(F) IC15.4(OI) IC35.13(B:A2) IC35.15(B:A3) IC35.17(B:A4) RS08.31 RS08.39 SV2.25 SV2.26 ; also sheet 1,2
N$4: IC21.4(A:Y0) SW1.1 SW1.2 SW1.3 SW1.4 SW1.5 SW1.6 SW1.7 SW1.8
N$14: IC13.8(A) IC14.8(A) IC15.6(ODD)
N$15: IC2.5(Y) IC5.2(A:I1)
N$17: IC21.5(A:Y1) SW2.1 SW2.2 SW2.3 SW2.4 SW2.5 SW2.6 SW2.7 SW2.8
N$19: IC21.6(A:Y2) SW3.1 SW3.2 SW3.3 SW3.4 SW3.5 SW3.6 SW3.7 SW3.8
N$20: IC21.7(A:Y3) SW4.1 SW4.2 SW4.3 SW4.4 SW4.5 SW4.6 SW4.7 SW4.8
N$21: IC3.5(Y) IC5.4(A:I2)
N$23: IC1.5(Y) IC5.1(A:I0)
N$24: IC4.5(Y) IC5.5(A:I3)
N$53: IC1.4(D0) SW1.16
N$54: IC1.3(D1) SW1.15
N$55: IC1.2(D2) SW1.14
N$56: IC1.1(D3) SW1.13
N$57: IC1.14(D5) SW1.11
N$58: IC1.13(D6) SW1.10
N$59: IC1.12(D7) SW1.9
N$60: IC1.15(D4) SW1.12
N$61: IC2.4(D0) SW2.16
N$62: IC2.3(D1) SW2.15
N$63: IC2.2(D2) SW2.14
N$64: IC2.1(D3) SW2.13
N$65: IC2.14(D5) SW2.11
N$66: IC2.13(D6) SW2.10
N$67: IC2.12(D7) SW2.9
N$68: IC3.4(D0) SW3.16
N$69: IC3.3(D1) SW3.15
N$70: IC3.2(D2) SW3.14
N$71: IC3.1(D3) SW3.13
N$72: IC3.14(D5) SW3.11
N$73: IC3.13(D6) SW3.10
N$74: IC3.12(D7) SW3.9
N$75: IC4.4(D0) SW4.16
N$76: IC4.3(D1) SW4.15
N$77: IC4.2(D2) SW4.14
N$78: IC4.1(D3) SW4.13
N$79: IC4.14(D5) SW4.11
N$80: IC4.13(D6) SW4.10
N$81: IC4.12(D7) SW4.9
N$82: IC4.15(D4) SW4.12
N$83: IC3.15(D4) SW3.12
N$84: IC2.15(D4) SW2.12
NXD: SV1.17 ; also sheet 2
PBIT: IC14.6(ODD) IC35.11(B:A1)
PER: SV1.21 ; also sheet 2
PIE: SV1.5 ; also sheet 2
PROTECT: IC5.6(A:O) ; also sheet 1
VCC [Power]: IC14.3(EI) IC15.3(EI) R2.2 RS08.2 SV1.25 SV1.26 ; also sheet 1,2
WLS: SV1.15 ; also sheet 2
WRITING: IC41.13(B:B) IC41.14(B:A) RS08.18 SV1.9 ; also sheet 1
Unconnected: IC1.6(W) IC2.6(W) IC3.6(W) IC4.6(W) IC13.6(ODD) IC14.5(EVN) IC15.5(EVN) IC21.10(B:Y2) IC21.11(B:Y1) IC21.12(B:Y0) IC35.3(B:Y4) IC35.5(B:Y3) IC35.7(B:Y2) IC41.5(A:Y1) IC41.6(A:Y2) IC41.10(B:Y2) IC41.11(B:Y1) SV1.7 SV1.13

### Notes on the sheet
- Data Storage
- Parity Generator | Parity Checker
- Write Protect Switches
- Memory Data Gating
- Indicator Connectors

## Power pins joined to a net without a drawn wire
GND: DAR4-7.8(GND) DAR8-11.8(GND) DMA0-3.8(GND) DMA4-7.8(GND) DMA8-11.8(GND) FIELD.8(GND) IC1.8(GND) IC2.8(GND) IC3.8(GND) IC4.8(GND) IC5.7(P:GND) IC6.8(P:GND) IC7.8(P:GND) IC9.7(P:GND) IC10.7(P:GND) IC11.7(P:GND) IC12.7(P:GND) IC13.7(GND) IC14.7(GND) IC15.7(GND) IC16.8(P:GND) IC17.8(P:GND) IC18.7(P:GND) IC19.7(P:GND) IC21.8(P:GND) IC22.7(P:GND) IC23.7(P:GND) IC24.10(P:GND) IC25.8(GND) IC26.10(P:GND) IC28.10(P:GND) IC29.8(GND) IC30.10(P:GND) IC31.10(P:GND) IC32.8(GND) IC34.10(P:GND) IC35.10(P:GND) IC36.8(GND) IC37.10(P:GND) IC38.10(P:GND) IC41.8(P:GND) IC55.7(P:GND) INTENB.8(GND)
VCC: DAR4-7.16(VCC) DAR8-11.16(VCC) DMA0-3.16(VCC) DMA4-7.16(VCC) DMA8-11.16(VCC) FIELD.16(VCC) IC1.16(VCC) IC2.16(VCC) IC3.16(VCC) IC4.16(VCC) IC5.14(P:VCC) IC6.16(P:VCC) IC7.16(P:VCC) IC9.14(P:VCC) IC10.14(P:VCC) IC11.14(P:VCC) IC12.14(P:VCC) IC13.14(VCC) IC14.14(VCC) IC15.14(VCC) IC16.16(P:VCC) IC17.16(P:VCC) IC18.14(P:VCC) IC19.14(P:VCC) IC21.16(P:VCC) IC22.14(P:VCC) IC23.14(P:VCC) IC24.20(P:VCC) IC25.16(VCC) IC26.20(P:VCC) IC28.20(P:VCC) IC29.16(VCC) IC30.20(P:VCC) IC31.20(P:VCC) IC32.16(VCC) IC34.20(P:VCC) IC35.20(P:VCC) IC36.16(VCC) IC37.20(P:VCC) IC38.20(P:VCC) IC41.16(P:VCC) IC55.14(P:VCC) INTENB.16(VCC)

## Library data of the parts
C1-C44 C46-C48 = rcl:C-US: CAPACITOR, American symbol
C35L C36L D34L D35L D36L RS08 = con-lstb:MA20-2: PIN HEADER; OC_FARNELL: unknown; OC_NEWARK: unknown
C45 = rcl:CPOL-US: POLARIZED CAPACITOR, American symbol
DAR4-7 DAR8-11 DMA0-3 DMA4-7 DMA8-11 FIELD INTENB = 74xx-us:74*192: Synchronous 4-bit UP/DOWN COUNTER
IC1-IC4 = 74xx-us:74*151: Data SELECTOR/MULTIPLEXER
IC5 = 74xx-us:74*20: Dual 4-input NAND gate
IC6 IC7 IC16 IC17 IC21 IC41 = 74xx-us:74*139: Dual 2-line to 4-line DECODER/DEMULTIPLEXER
IC8 = linear:*555: TIMER
IC9-IC11 IC23 = 74xx-us:74*74: Dual D type positive edge triggered FLIP FLOP, preset and clear
IC12 = 74xx-us:74*04: Hex INVERTER
IC13-IC15 = 74xx-us:74*180: 9-bit odd/even PARITY GENERATOR/CHECKER
IC18 = 74xx-us:74*00: Quad 2-input NAND gate
IC19 IC22 = 74xx-us:74*07: Hex BUFFER, open collector high-voltage output
IC20 = ic-package:DIL20: Dual In Line / Socket
IC24 IC26 IC30 IC31 IC34 IC37 IC38 = 74xx-us:74*240: Octal BUFFER and LINE DRIVER, 3-state
IC25 IC29 IC32 IC36 = 74xx-us:74*138: 3-line to 8-line DECODER/DEMULTIPLEXER
IC28 IC35 = 74xx-us:74*244: Octal BUFFER and LINE DRIVER, 3-state
IC55 = dec-con:74*38: Quad 2-input NAND gate, open collector output
J2-J14 = jumper:J: Bridge
PAD1-PAD9 = wirepad:1,6/0,8: THROUGH-HOLE PAD
R1 R2 RA RB RL = rcl:R-US_: RESISTOR, American symbol
SV1 SV2 = con-lstb:MA13-2: PIN HEADER; OC_FARNELL: unknown; OC_NEWARK: unknown
SW1-SW4 = special:SW_DIP-8: DIP SWITCH

## Net classes
1 Power: width 0.508 mm